# Altium schematic sheet Block_Diagram.SchDoc
size A2; SheetNumber: 2; SheetTotal: 9
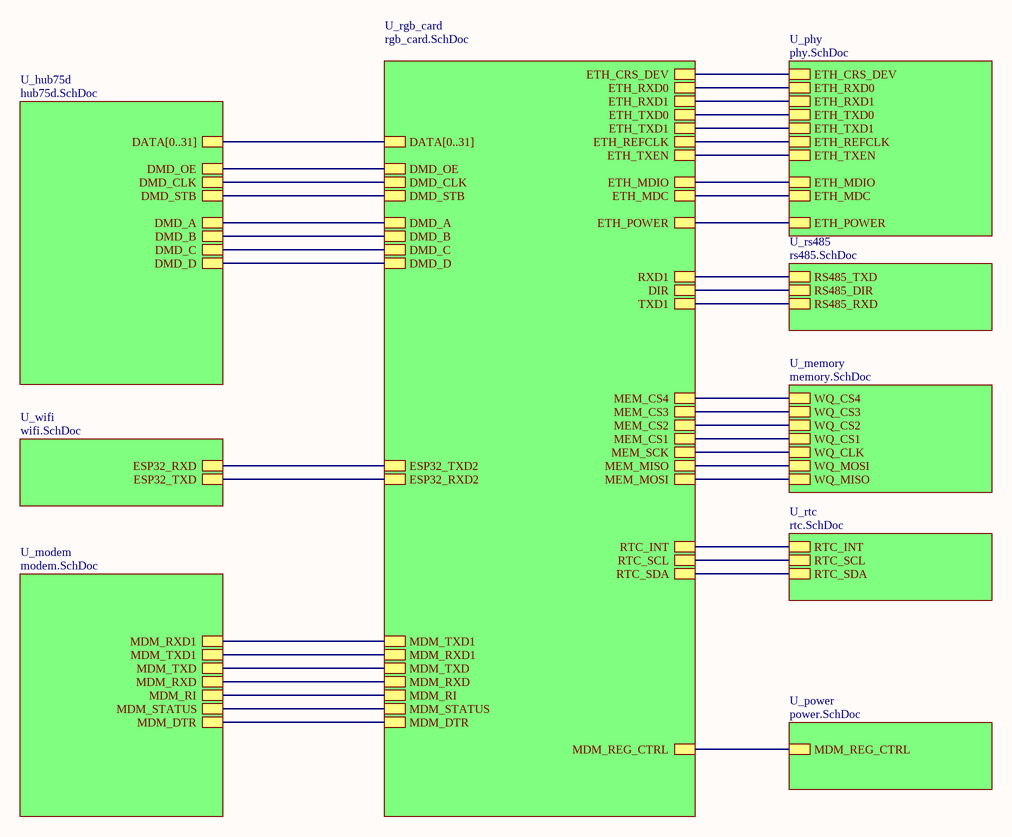
[diagram p0: Block_Diagram.SchDoc]

## Sub-sheets
U_hub75d = hub75d.SchDoc: DATA[0..31], DMD_OE, DMD_B, DMD_STB, DMD_D, DMD_C, DMD_CLK, DMD_A
U_memory = memory.SchDoc: WQ_CS1, WQ_MOSI, WQ_MISO, WQ_CLK, WQ_CS2, WQ_CS3, WQ_CS4
U_modem = modem.SchDoc: MDM_RXD, MDM_RXD1, MDM_RI, MDM_TXD, MDM_TXD1, MDM_STATUS, MDM_DTR
U_phy = phy.SchDoc: ETH_CRS_DEV, ETH_RXD0, ETH_RXD1, ETH_TXD0, ETH_TXD1, ETH_REFCLK, ETH_TXEN, ETH_MDIO, ETH_MDC, ETH_POWER
U_power = power.SchDoc: MDM_REG_CTRL
U_rgb_card = rgb_card.SchDoc: ESP32_TXD2, ESP32_RXD2, TXD1, RXD1, DIR, MEM_CS1, MEM_SCK, MEM_MISO, MEM_MOSI, DMD_D, DMD_OE, DMD_C, DMD_STB, DMD_B, DMD_CLK, DMD_A, DATA[0..31], MEM_CS3, MEM_CS2, MEM_CS4, ETH_TXD0, ETH_CRS_DEV, ETH_TXD1, ETH_REFCLK, ETH_RXD1, ETH_RXD0, ETH_TXEN, ETH_MDIO, ETH_MDC, ETH_POWER, RTC_SDA, RTC_SCL, RTC_INT, MDM_DTR, MDM_STATUS, MDM_TXD, MDM_TXD1, MDM_RXD, MDM_RXD1, MDM_RI, MDM_REG_CTRL
U_rs485 = rs485.SchDoc: RS485_TXD, RS485_DIR, RS485_RXD
U_rtc = rtc.SchDoc: RTC_INT, RTC_SCL, RTC_SDA
U_wifi = wifi.SchDoc: ESP32_RXD, ESP32_TXD

## Nets
(unnamed): sheet U_rgb_card/ESP32_TXD2, sheet U_wifi/ESP32_RXD
(unnamed): sheet U_rgb_card/ESP32_RXD2, sheet U_wifi/ESP32_TXD
(unnamed): sheet U_rgb_card/TXD1, sheet U_rs485/RS485_RXD
(unnamed): sheet U_rgb_card/RXD1, sheet U_rs485/RS485_TXD
(unnamed): sheet U_rgb_card/DIR, sheet U_rs485/RS485_DIR
(unnamed): sheet U_rgb_card/MEM_CS1, sheet U_memory/WQ_CS1
(unnamed): sheet U_rgb_card/MEM_SCK, sheet U_memory/WQ_CLK
(unnamed): sheet U_rgb_card/MEM_MISO, sheet U_memory/WQ_MOSI
(unnamed): sheet U_rgb_card/MEM_MOSI, sheet U_memory/WQ_MISO
(unnamed): sheet U_rgb_card/DMD_D, sheet U_hub75d/DMD_D
(unnamed): sheet U_rgb_card/DMD_OE, sheet U_hub75d/DMD_OE
(unnamed): sheet U_rgb_card/DMD_C, sheet U_hub75d/DMD_C
(unnamed): sheet U_rgb_card/DMD_STB, sheet U_hub75d/DMD_STB
(unnamed): sheet U_rgb_card/DMD_B, sheet U_hub75d/DMD_B
(unnamed): sheet U_rgb_card/DMD_CLK, sheet U_hub75d/DMD_CLK
(unnamed): sheet U_rgb_card/DMD_A, sheet U_hub75d/DMD_A
(unnamed): sheet U_rgb_card/MEM_CS3, sheet U_memory/WQ_CS3
(unnamed): sheet U_rgb_card/MEM_CS2, sheet U_memory/WQ_CS2
(unnamed): sheet U_rgb_card/MEM_CS4, sheet U_memory/WQ_CS4
(unnamed): sheet U_rgb_card/ETH_TXD0, sheet U_phy/ETH_TXD0
(unnamed): sheet U_rgb_card/ETH_CRS_DEV, sheet U_phy/ETH_CRS_DEV
(unnamed): sheet U_rgb_card/ETH_TXD1, sheet U_phy/ETH_TXD1
(unnamed): sheet U_rgb_card/ETH_REFCLK, sheet U_phy/ETH_REFCLK
(unnamed): sheet U_rgb_card/ETH_RXD1, sheet U_phy/ETH_RXD1
(unnamed): sheet U_rgb_card/ETH_RXD0, sheet U_phy/ETH_RXD0
(unnamed): sheet U_rgb_card/ETH_TXEN, sheet U_phy/ETH_TXEN
(unnamed): sheet U_rgb_card/ETH_MDIO, sheet U_phy/ETH_MDIO
(unnamed): sheet U_rgb_card/ETH_MDC, sheet U_phy/ETH_MDC
(unnamed): sheet U_rgb_card/ETH_POWER, sheet U_phy/ETH_POWER
(unnamed): sheet U_rgb_card/RTC_SDA, sheet U_rtc/RTC_SDA
(unnamed): sheet U_rgb_card/RTC_SCL, sheet U_rtc/RTC_SCL
(unnamed): sheet U_rgb_card/RTC_INT, sheet U_rtc/RTC_INT
(unnamed): sheet U_rgb_card/MDM_DTR, sheet U_modem/MDM_DTR
(unnamed): sheet U_rgb_card/MDM_STATUS, sheet U_modem/MDM_STATUS
(unnamed): sheet U_rgb_card/MDM_TXD, sheet U_modem/MDM_TXD
(unnamed): sheet U_rgb_card/MDM_TXD1, sheet U_modem/MDM_RXD1
(unnamed): sheet U_rgb_card/MDM_RXD, sheet U_modem/MDM_RXD
(unnamed): sheet U_rgb_card/MDM_RXD1, sheet U_modem/MDM_TXD1
(unnamed): sheet U_rgb_card/MDM_RI, sheet U_modem/MDM_RI
(unnamed): sheet U_rgb_card/MDM_REG_CTRL, sheet U_power/MDM_REG_CTRL

## Buses and harness runs
bus sheet U_hub75d/DATA[0..31] = sheet U_rgb_card/DATA[0..31]

## Notes on the sheet
- CONFIDENTAL. Do not distribute.
- Page Contents:
- Title:
- Company
- Logo
- Date:
- SIZE:
- A2
- DWG Num:
- Time:
- Variant:
- Sheet
- Revision:
- of
- Drawn by:
- Checked by: